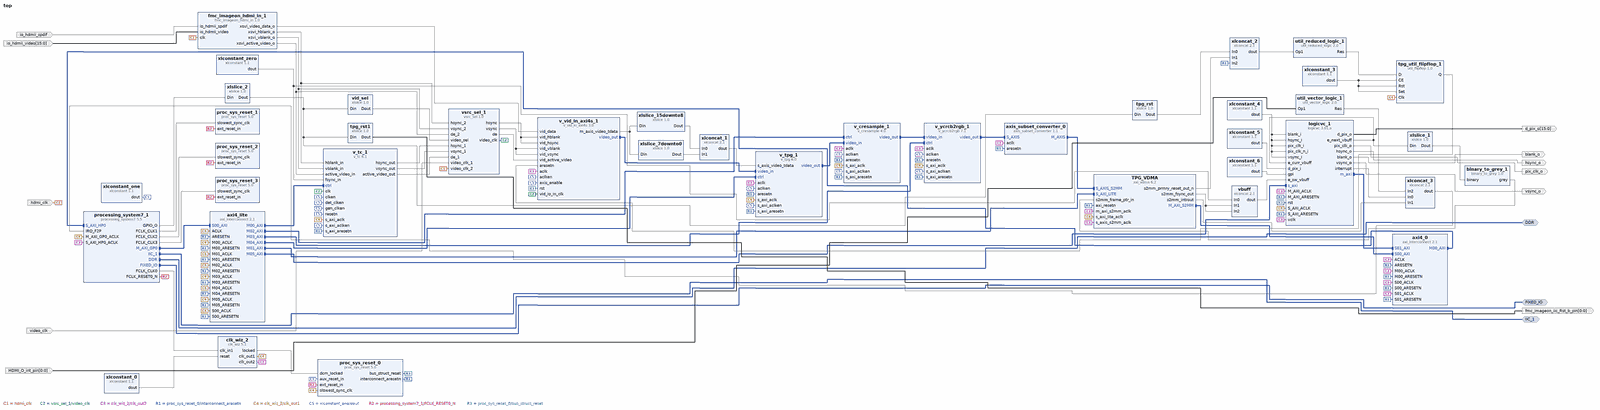
[diagram p0: block diagram of the top level, whole]
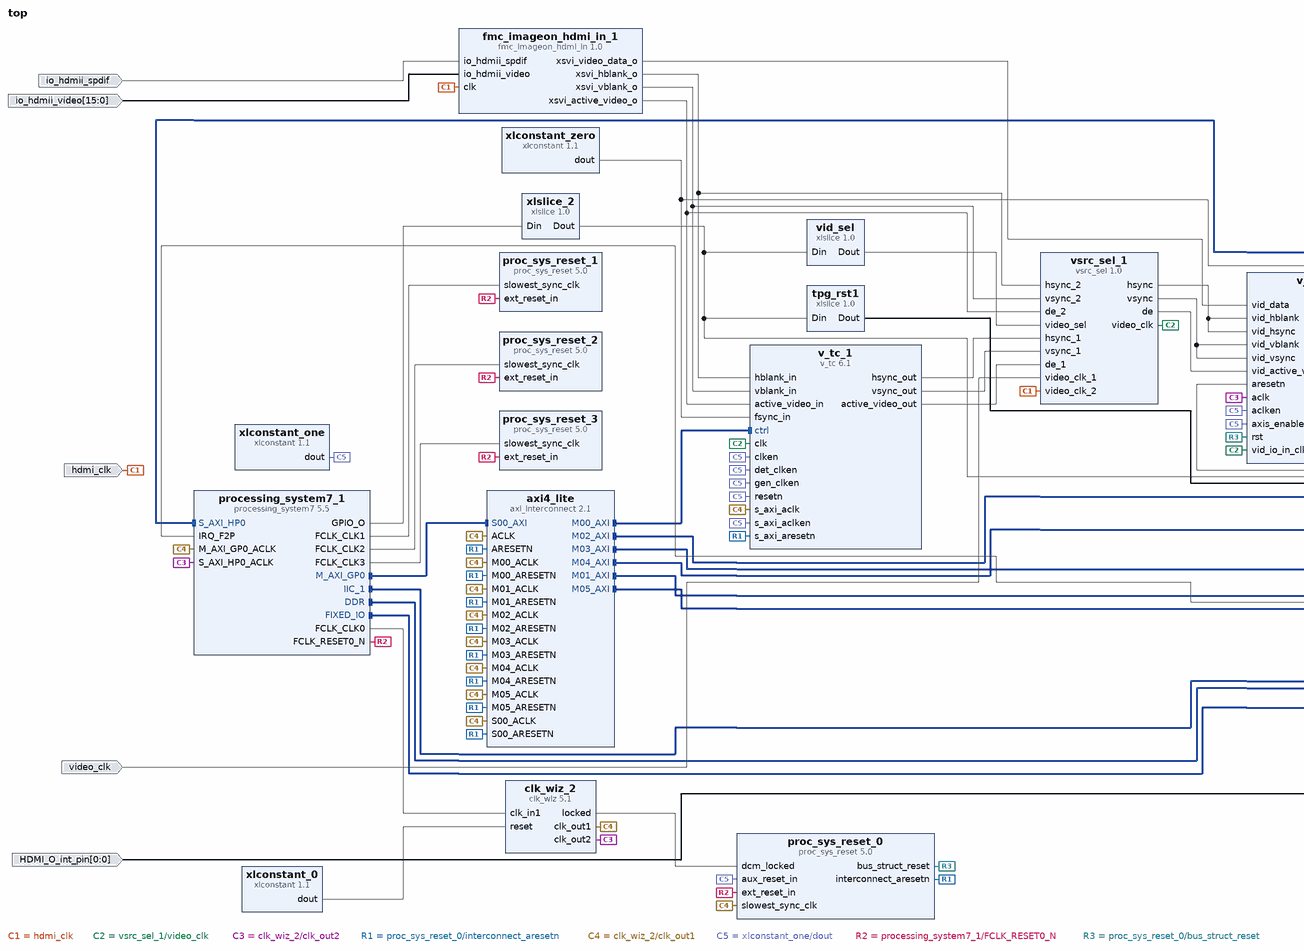
[diagram p1: block diagram of the top level, left part]
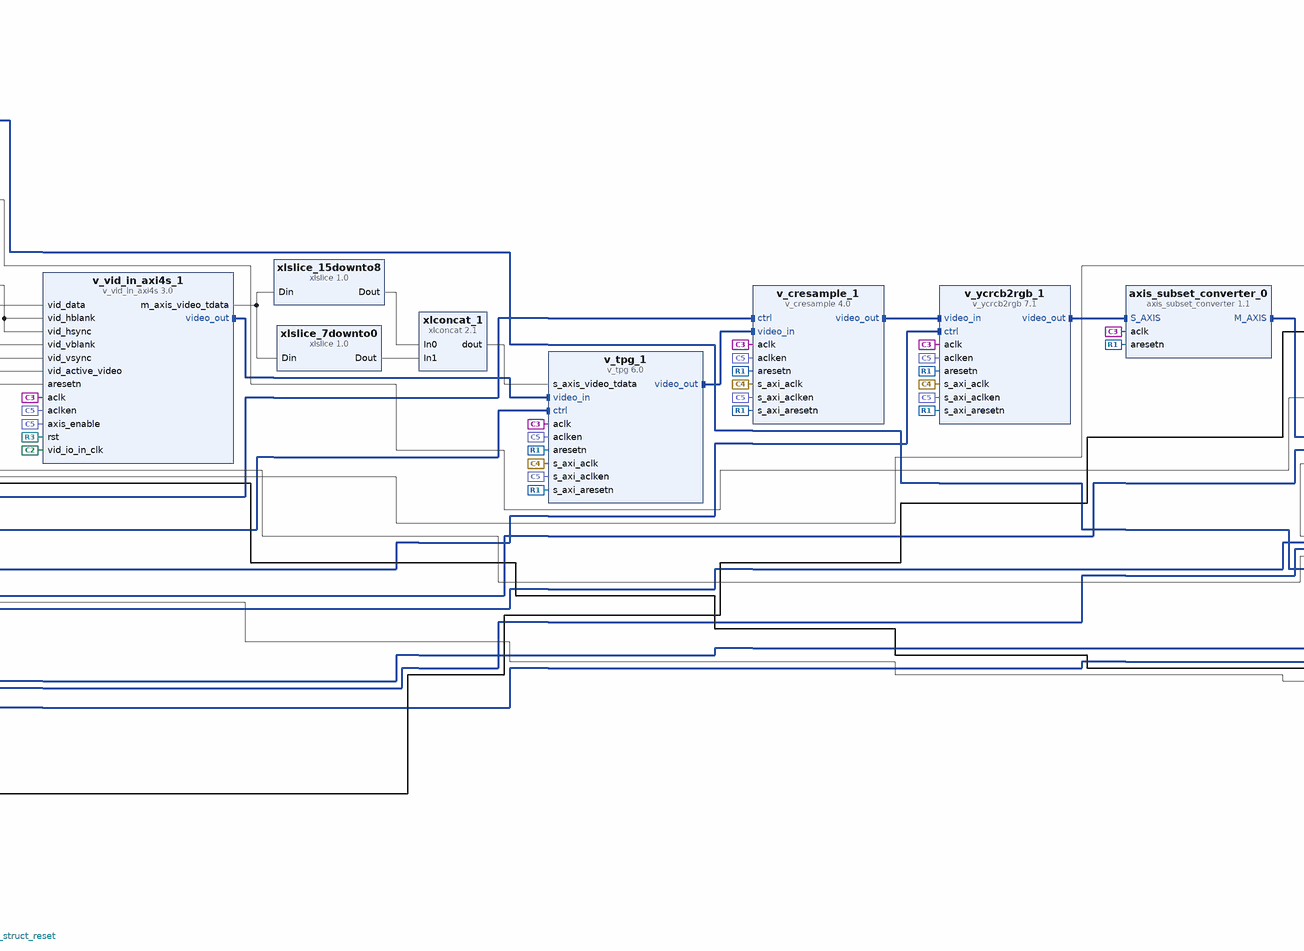
[diagram p2: block diagram of the top level, centre part]
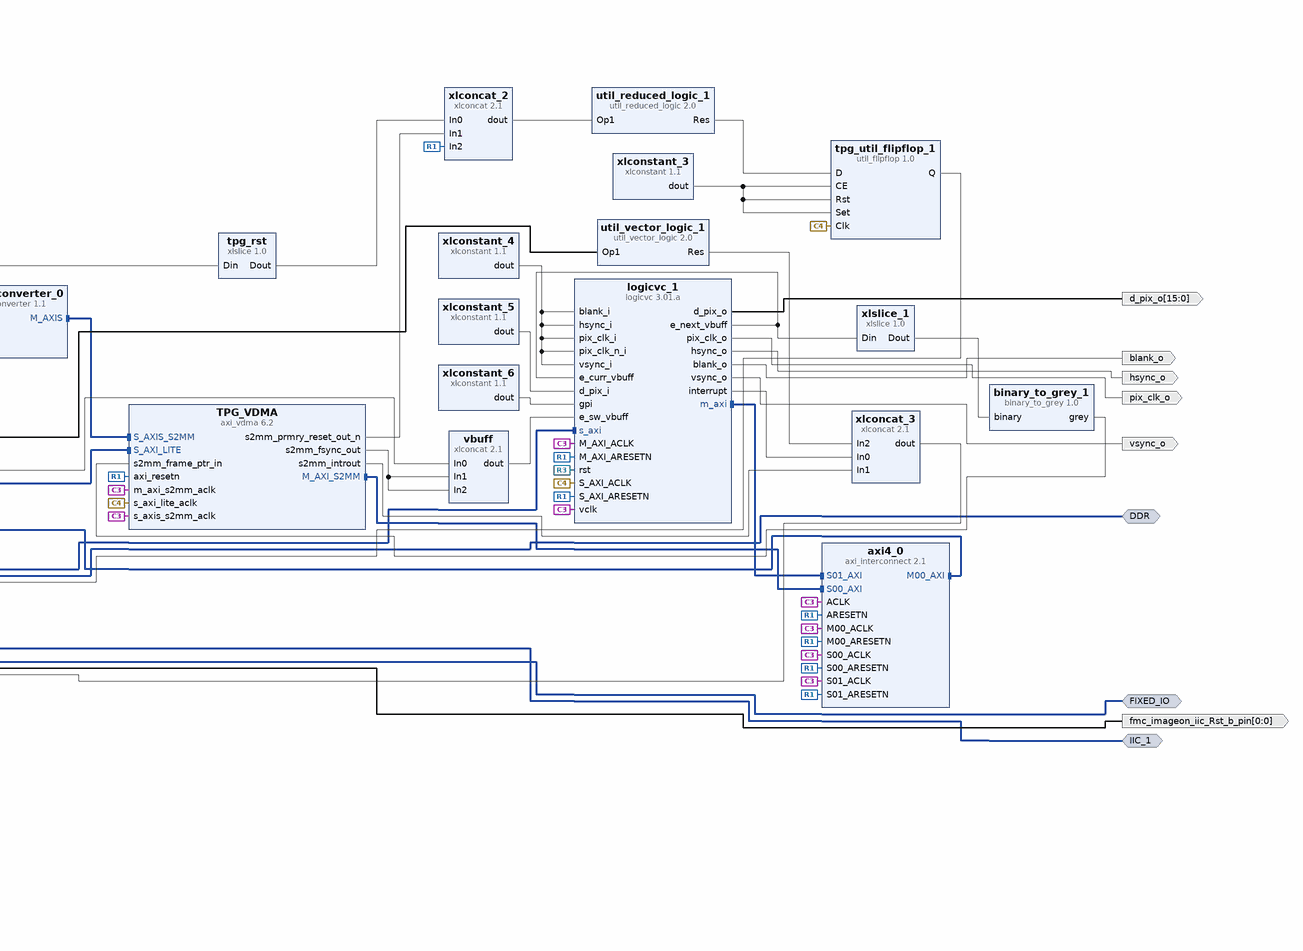
[diagram p3: block diagram of the top level, right part]
# Vivado block design top, Vivado 2015.2
create_bd_design top

create_bd_intf_port -mode Master -vlnv xilinx.com:interface:iic_rtl:1.0 IIC_1
create_bd_intf_port -mode Master -vlnv xilinx.com:interface:ddrx_rtl:1.0 DDR
create_bd_intf_port -mode Master -vlnv xilinx.com:display_processing_system7:fixedio_rtl:1.0 FIXED_IO
create_bd_port -dir I hdmi_clk
create_bd_port -dir I io_hdmii_spdif
create_bd_port -dir I -from 15 -to 0 io_hdmii_video
create_bd_port -dir I video_clk
create_bd_port -dir O -from 0 -to 0 fmc_imageon_iic_Rst_b_pin
create_bd_port -dir O pix_clk_o
create_bd_port -dir O -from 15 -to 0 d_pix_o
create_bd_port -dir O hsync_o
create_bd_port -dir O vsync_o
create_bd_port -dir O blank_o
create_bd_port -dir I -from 0 -to 0 HDMI_O_int_pin

create_bd_cell -type ip -vlnv xilinx.com:ip:fmc_imageon_hdmi_in:1.0 fmc_imageon_hdmi_in_1
create_bd_cell -type ip -vlnv xilinx.com:user:vsrc_sel:1.0 vsrc_sel_1
set_property -dict {CONFIG.C_NUM_CHANNELS 1} [get_bd_cells vsrc_sel_1]
create_bd_cell -type ip -vlnv xilinx.com:ip:xlslice:1.0 vid_sel
set_property -dict {CONFIG.DIN_TO 3 CONFIG.DIN_FROM 3 CONFIG.DIN_WIDTH 8} [get_bd_cells vid_sel]
create_bd_cell -type ip -vlnv xilinx.com:ip:xlslice:1.0 tpg_rst1
set_property -dict {CONFIG.DIN_TO 6 CONFIG.DIN_FROM 6 CONFIG.DIN_WIDTH 8} [get_bd_cells tpg_rst1]
create_bd_cell -type ip -vlnv xilinx.com:ip:xlslice:1.0 tpg_rst
set_property -dict {CONFIG.DIN_WIDTH 8} [get_bd_cells tpg_rst]
create_bd_cell -type ip -vlnv xilinx.com:user:util_flipflop:1.0 tpg_util_flipflop_1
set_property -dict [list \
  CONFIG.C_SIZE 1 \
  CONFIG.C_USE_ASYNCH 0 \
  CONFIG.C_USE_CE 0 \
  CONFIG.C_USE_SET 0 \
  CONFIG.C_USE_RST 0 \
  CONFIG.C_SET_RST_HIGH 0 \
] [get_bd_cells tpg_util_flipflop_1]
create_bd_cell -type ip -vlnv xilinx.com:ip:xlslice:1.0 xlslice_15downto8
set_property -dict {CONFIG.DIN_TO 8 CONFIG.DIN_FROM 15 CONFIG.DIN_WIDTH 16} [get_bd_cells xlslice_15downto8]
create_bd_cell -type ip -vlnv xilinx.com:ip:xlslice:1.0 xlslice_7downto0
set_property -dict {CONFIG.DIN_TO 0 CONFIG.DIN_FROM 7 CONFIG.DIN_WIDTH 16} [get_bd_cells xlslice_7downto0]
create_bd_cell -type ip -vlnv xilinx.com:ip:xlslice:1.0 xlslice_1
set_property -dict {CONFIG.DIN_TO 2 CONFIG.DIN_FROM 3 CONFIG.DIN_WIDTH 6} [get_bd_cells xlslice_1]
create_bd_cell -type ip -vlnv xylon:logicbricks:logicvc:3.01.a logicvc_1
set_property -dict [list \
  CONFIG.C_BUFFER_1_OFFSET 1080 \
  CONFIG.C_BUFFER_0_OFFSET 1080 \
  CONFIG.C_LAYER_1_OFFSET 1620 \
  CONFIG.C_USE_XTREME_DSP 1 \
  CONFIG.C_USE_BACKGROUND 1 \
  CONFIG.C_LAYER_2_DATA_WIDTH 24 \
  CONFIG.C_LAYER_1_DATA_WIDTH 24 \
  CONFIG.C_NUM_OF_LAYERS 3 \
  CONFIG.C_DISPLAY_COLOR_SPACE 1 \
  CONFIG.C_DISPLAY_INTERFACE 0 \
  CONFIG.C_ROW_STRIDE 2048 \
  CONFIG.C_M_AXI_DATA_WIDTH 64 \
  CONFIG.C_INCREASE_FIFO 2 \
  CONFIG.C_VMEM_HIGHADDR 0x37ffffff \
  CONFIG.C_VMEM_BASEADDR 0x30000000 \
] [get_bd_cells logicvc_1]
create_bd_cell -type ip -vlnv xilinx.com:user:binary_to_grey:1.0 binary_to_grey_1
create_bd_cell -type ip -vlnv xilinx.com:ip:xlslice:1.0 xlslice_2
set_property -dict {CONFIG.DIN_FROM 7 CONFIG.DIN_WIDTH 64} [get_bd_cells xlslice_2]
create_bd_cell -type ip -vlnv xilinx.com:ip:util_reduced_logic:2.0 util_reduced_logic_1
set_property -dict {CONFIG.C_SIZE 3} [get_bd_cells util_reduced_logic_1]
create_bd_cell -type ip -vlnv xilinx.com:ip:util_vector_logic:2.0 util_vector_logic_1
set_property -dict {CONFIG.C_SIZE 1 CONFIG.C_OPERATION not} [get_bd_cells util_vector_logic_1]
create_bd_cell -type ip -vlnv xilinx.com:ip:xlconcat:2.1 vbuff
set_property -dict {CONFIG.NUM_PORTS 3} [get_bd_cells vbuff]
create_bd_cell -type ip -vlnv xilinx.com:ip:xlconcat:2.1 xlconcat_1
set_property -dict {CONFIG.IN0_WIDTH 8 CONFIG.IN1_WIDTH 8} [get_bd_cells xlconcat_1]
create_bd_cell -type ip -vlnv xilinx.com:ip:xlconcat:2.1 xlconcat_2
set_property -dict {CONFIG.NUM_PORTS 3} [get_bd_cells xlconcat_2]
create_bd_cell -type ip -vlnv xilinx.com:ip:xlconcat:2.1 xlconcat_3
set_property -dict {CONFIG.NUM_PORTS 3} [get_bd_cells xlconcat_3]
create_bd_cell -type ip -vlnv xilinx.com:ip:xlconstant:1.1 xlconstant_0
set_property -dict {CONFIG.CONST_VAL 0} [get_bd_cells xlconstant_0]
create_bd_cell -type ip -vlnv xilinx.com:ip:xlconstant:1.1 xlconstant_3
create_bd_cell -type ip -vlnv xilinx.com:ip:xlconstant:1.1 xlconstant_4
set_property -dict {CONFIG.CONST_VAL 0} [get_bd_cells xlconstant_4]
create_bd_cell -type ip -vlnv xilinx.com:ip:xlconstant:1.1 xlconstant_5
set_property -dict {CONFIG.CONST_WIDTH 16 CONFIG.CONST_VAL 0} [get_bd_cells xlconstant_5]
create_bd_cell -type ip -vlnv xilinx.com:ip:xlconstant:1.1 xlconstant_6
set_property -dict {CONFIG.CONST_WIDTH 5 CONFIG.CONST_VAL 0} [get_bd_cells xlconstant_6]
create_bd_cell -type ip -vlnv xilinx.com:ip:xlconstant:1.1 xlconstant_one
create_bd_cell -type ip -vlnv xilinx.com:ip:xlconstant:1.1 xlconstant_zero
set_property -dict {CONFIG.CONST_VAL 0} [get_bd_cells xlconstant_zero]
create_bd_cell -type ip -vlnv xilinx.com:ip:axis_subset_converter:1.1 axis_subset_converter_0
set_property -dict [list \
  CONFIG.S_TDATA_NUM_BYTES 3 \
  CONFIG.M_TDATA_NUM_BYTES 4 \
  CONFIG.S_TUSER_WIDTH 1 \
  CONFIG.M_TUSER_WIDTH 1 \
  CONFIG.S_HAS_TKEEP 0 \
  CONFIG.S_HAS_TLAST 1 \
  CONFIG.M_HAS_TKEEP 1 \
  CONFIG.M_HAS_TLAST 1 \
  CONFIG.TDATA_REMAP {8'b11111111,tdata[23:16],tdata[7:0],tdata[15:8]} \
  CONFIG.TUSER_REMAP {tuser[0:0]} \
] [get_bd_cells axis_subset_converter_0]
create_bd_cell -type ip -vlnv xilinx.com:ip:proc_sys_reset:5.0 proc_sys_reset_0
set_property -dict {CONFIG.C_AUX_RESET_HIGH 0} [get_bd_cells proc_sys_reset_0]
create_bd_cell -type ip -vlnv xilinx.com:ip:proc_sys_reset:5.0 proc_sys_reset_1
set_property -dict {CONFIG.C_AUX_RESET_HIGH 0} [get_bd_cells proc_sys_reset_1]
create_bd_cell -type ip -vlnv xilinx.com:ip:proc_sys_reset:5.0 proc_sys_reset_2
set_property -dict {CONFIG.C_AUX_RESET_HIGH 0} [get_bd_cells proc_sys_reset_2]
create_bd_cell -type ip -vlnv xilinx.com:ip:proc_sys_reset:5.0 proc_sys_reset_3
set_property -dict {CONFIG.C_AUX_RESET_HIGH 0} [get_bd_cells proc_sys_reset_3]
create_bd_cell -type ip -vlnv xilinx.com:ip:processing_system7:5.5 processing_system7_1
set_property -dict [list \
  CONFIG.PCW_FCLK_CLK1_BUF true \
  CONFIG.PCW_FCLK_CLK2_BUF true \
  CONFIG.PCW_FCLK_CLK3_BUF true \
  CONFIG.PCW_UIPARAM_DDR_FREQ_MHZ 533.333333 \
  CONFIG.PCW_APU_PERIPHERAL_FREQMHZ 666.666666 \
  CONFIG.PCW_SDIO_PERIPHERAL_FREQMHZ 50 \
  CONFIG.PCW_UART_PERIPHERAL_FREQMHZ 50 \
  CONFIG.PCW_I2C_PERIPHERAL_FREQMHZ 111.111115 \
  CONFIG.PCW_FPGA0_PERIPHERAL_FREQMHZ 100 \
  CONFIG.PCW_FPGA1_PERIPHERAL_FREQMHZ 142 \
  CONFIG.PCW_FPGA2_PERIPHERAL_FREQMHZ 100 \
  CONFIG.PCW_FPGA3_PERIPHERAL_FREQMHZ 166.666672 \
  CONFIG.PCW_USE_S_AXI_HP0 1 \
  CONFIG.PCW_M_AXI_GP0_FREQMHZ 75 \
  CONFIG.PCW_S_AXI_HP0_FREQMHZ 150 \
  CONFIG.PCW_USE_FABRIC_INTERRUPT 1 \
  CONFIG.PCW_EN_CLK1_PORT 1 \
  CONFIG.PCW_EN_CLK2_PORT 1 \
  CONFIG.PCW_EN_CLK3_PORT 1 \
  CONFIG.PCW_IRQ_F2P_INTR 1 \
  CONFIG.PCW_PERIPHERAL_BOARD_PRESET part0 \
  CONFIG.PCW_PRESET_BANK0_VOLTAGE {LVCMOS 1.8V} \
  CONFIG.PCW_PRESET_BANK1_VOLTAGE {LVCMOS 1.8V} \
  CONFIG.PCW_UIPARAM_DDR_PARTNO {MT41J256M8 HX-15E} \
  CONFIG.PCW_QSPI_PERIPHERAL_ENABLE 0 \
  CONFIG.PCW_ENET0_PERIPHERAL_ENABLE 1 \
  CONFIG.PCW_ENET0_ENET0_IO {MIO 16 .. 27} \
  CONFIG.PCW_ENET0_GRP_MDIO_ENABLE 1 \
  CONFIG.PCW_ENET0_GRP_MDIO_IO {MIO 52 .. 53} \
  CONFIG.PCW_ENET0_RESET_ENABLE 1 \
  CONFIG.PCW_ENET0_RESET_IO {MIO 11} \
  CONFIG.PCW_SD0_PERIPHERAL_ENABLE 1 \
  CONFIG.PCW_SD0_SD0_IO {MIO 40 .. 45} \
  CONFIG.PCW_SD0_GRP_CD_ENABLE 1 \
  CONFIG.PCW_SD0_GRP_CD_IO {MIO 0} \
  CONFIG.PCW_SD0_GRP_WP_ENABLE 1 \
  CONFIG.PCW_SD0_GRP_WP_IO {MIO 15} \
  CONFIG.PCW_UART1_PERIPHERAL_ENABLE 1 \
  CONFIG.PCW_UART1_UART1_IO {MIO 48 .. 49} \
  CONFIG.PCW_TTC0_PERIPHERAL_ENABLE 1 \
  CONFIG.PCW_TTC0_TTC0_IO EMIO \
  CONFIG.PCW_USB0_PERIPHERAL_ENABLE 1 \
  CONFIG.PCW_USB0_USB0_IO {MIO 28 .. 39} \
  CONFIG.PCW_USB0_RESET_ENABLE 1 \
  CONFIG.PCW_USB0_RESET_IO {MIO 7} \
  CONFIG.PCW_I2C0_PERIPHERAL_ENABLE 1 \
  CONFIG.PCW_I2C0_I2C0_IO {MIO 50 .. 51} \
  CONFIG.PCW_I2C0_GRP_INT_ENABLE 0 \
  CONFIG.PCW_I2C0_RESET_ENABLE 1 \
  CONFIG.PCW_I2C0_RESET_IO {MIO 13} \
  CONFIG.PCW_I2C1_PERIPHERAL_ENABLE 1 \
  CONFIG.PCW_I2C1_I2C1_IO EMIO \
  CONFIG.PCW_GPIO_MIO_GPIO_ENABLE 1 \
  CONFIG.PCW_GPIO_MIO_GPIO_IO MIO \
  CONFIG.PCW_GPIO_EMIO_GPIO_ENABLE 1 \
  CONFIG.PCW_GPIO_EMIO_GPIO_IO 64 \
  CONFIG.PCW_ENET0_PERIPHERAL_FREQMHZ {100 Mbps} \
  CONFIG.PCW_DCI_PERIPHERAL_CLKSRC 1 \
  CONFIG.PCW_PCAP_PERIPHERAL_CLKSRC 1 \
  CONFIG.preset ZC702 \
  CONFIG.PCW_FPGA_FCLK1_ENABLE 1 \
  CONFIG.PCW_FPGA_FCLK2_ENABLE 1 \
  CONFIG.PCW_FPGA_FCLK3_ENABLE 1 \
] [get_bd_cells processing_system7_1]
# 359 more settings of processing_system7_1 are not shown: defaults, MIO pin electricals, DDR timing, and values the tool derives
create_bd_cell -type ip -vlnv xilinx.com:ip:v_cresample:4.0 v_cresample_1
set_property -dict {CONFIG.has_axi4_lite true CONFIG.convert_type 2} [get_bd_cells v_cresample_1]
create_bd_cell -type ip -vlnv xilinx.com:ip:v_tc:6.1 v_tc_1
set_property -dict [list \
  CONFIG.VIDEO_MODE 1080p \
  CONFIG.enable_detection true \
  CONFIG.vertical_blank_generation true \
  CONFIG.horizontal_sync_detection false \
  CONFIG.vertical_sync_detection false \
] [get_bd_cells v_tc_1]
create_bd_cell -type ip -vlnv xilinx.com:ip:v_tpg:6.0 v_tpg_1
set_property -dict {CONFIG.pattern_control 10} [get_bd_cells v_tpg_1]
create_bd_cell -type ip -vlnv xilinx.com:ip:v_vid_in_axi4s:3.0 v_vid_in_axi4s_1
set_property -dict {CONFIG.C_M_AXIS_VIDEO_FORMAT 0} [get_bd_cells v_vid_in_axi4s_1]
create_bd_cell -type ip -vlnv xilinx.com:ip:v_ycrcb2rgb:7.1 v_ycrcb2rgb_1
set_property -dict [list \
  CONFIG.HAS_AXI4_LITE true \
  CONFIG.HAS_INTC_IF false \
  CONFIG.Standard_Sel HD_ITU_709__1250_PAL \
  CONFIG.Output_Range 0_to_255_for_Computer_Graphics \
] [get_bd_cells v_ycrcb2rgb_1]
create_bd_cell -type ip -vlnv xilinx.com:ip:axi_vdma:6.2 TPG_VDMA
set_property -dict [list \
  CONFIG.c_m_axi_s2mm_data_width 64 \
  CONFIG.c_include_s2mm_dre 0 \
  CONFIG.c_include_s2mm_sf 0 \
  CONFIG.c_s2mm_sof_enable 1 \
  CONFIG.c_s2mm_genlock_mode 3 \
  CONFIG.c_s2mm_linebuffer_depth 4096 \
  CONFIG.c_include_mm2s 0 \
  CONFIG.c_s2mm_max_burst_length 16 \
  CONFIG.c_enable_debug_info_6 0 \
  CONFIG.c_enable_debug_info_7 0 \
  CONFIG.c_enable_debug_info_8 1 \
  CONFIG.c_enable_debug_info_11 1 \
  CONFIG.c_enable_debug_info_14 0 \
  CONFIG.c_enable_debug_info_15 1 \
] [get_bd_cells TPG_VDMA]
create_bd_cell -type ip -vlnv xilinx.com:ip:axi_interconnect:2.1 axi4_0
set_property -dict [list \
  CONFIG.NUM_SI 2 \
  CONFIG.NUM_MI 1 \
  CONFIG.STRATEGY 2 \
  CONFIG.ENABLE_ADVANCED_OPTIONS 1 \
  CONFIG.M00_HAS_REGSLICE 1 \
  CONFIG.M00_HAS_DATA_FIFO 2 \
  CONFIG.S00_HAS_REGSLICE 1 \
  CONFIG.S01_HAS_REGSLICE 1 \
] [get_bd_cells axi4_0]
create_bd_cell -type ip -vlnv xilinx.com:ip:axi_interconnect:2.1 axi4_lite
set_property -dict {CONFIG.NUM_MI 6 CONFIG.M06_HAS_REGSLICE 1} [get_bd_cells axi4_lite]
create_bd_cell -type ip -vlnv xilinx.com:ip:clk_wiz:5.1 clk_wiz_2
set_property -dict [list \
  CONFIG.USE_INCLK_SWITCHOVER false \
  CONFIG.CLKOUT2_USED true \
  CONFIG.NUM_OUT_CLKS 2 \
  CONFIG.CLKOUT1_REQUESTED_OUT_FREQ 75.000 \
  CONFIG.CLKOUT2_REQUESTED_OUT_FREQ 150.000 \
  CONFIG.CLKOUT1_JITTER 133.854 \
  CONFIG.CLKOUT1_PHASE_ERROR 94.994 \
  CONFIG.CLKOUT2_JITTER 116.798 \
  CONFIG.CLKOUT2_PHASE_ERROR 94.994 \
] [get_bd_cells clk_wiz_2]

# ---- connections ----

connect_bd_intf_net [get_bd_intf_pins v_ycrcb2rgb_1/video_out] [get_bd_intf_pins axis_subset_converter_0/S_AXIS]
connect_bd_intf_net -intf_net axi_interconnect_1_m00_axi [get_bd_intf_pins axi4_0/M00_AXI] [get_bd_intf_pins processing_system7_1/S_AXI_HP0]
connect_bd_intf_net -intf_net axi_vdma_1_m_axi_s2mm [get_bd_intf_pins TPG_VDMA/M_AXI_S2MM] [get_bd_intf_pins axi4_0/S00_AXI]
connect_bd_intf_net [get_bd_intf_pins v_cresample_1/video_out] [get_bd_intf_pins v_ycrcb2rgb_1/video_in]
connect_bd_intf_net -intf_net axi_interconnect_2_m00_axi [get_bd_intf_pins axi4_lite/M00_AXI] [get_bd_intf_pins v_tc_1/ctrl]
connect_bd_intf_net -intf_net axi_interconnect_2_m02_axi [get_bd_intf_pins axi4_lite/M02_AXI] [get_bd_intf_pins v_cresample_1/ctrl]
connect_bd_intf_net -intf_net axi_interconnect_2_m03_axi [get_bd_intf_pins axi4_lite/M03_AXI] [get_bd_intf_pins v_ycrcb2rgb_1/ctrl]
connect_bd_intf_net [get_bd_intf_pins axi4_lite/S00_AXI] [get_bd_intf_pins processing_system7_1/M_AXI_GP0]
connect_bd_intf_net -intf_net axi_interconnect_2_m01_axi [get_bd_intf_pins TPG_VDMA/S_AXI_LITE] [get_bd_intf_pins axi4_lite/M01_AXI]
connect_bd_intf_net [get_bd_intf_pins v_tpg_1/video_out] [get_bd_intf_pins v_cresample_1/video_in]
connect_bd_intf_net [get_bd_intf_pins v_vid_in_axi4s_1/video_out] [get_bd_intf_pins v_tpg_1/video_in]
connect_bd_intf_net -intf_net axi_interconnect_2_m04_axi [get_bd_intf_pins axi4_lite/M04_AXI] [get_bd_intf_pins v_tpg_1/ctrl]
connect_bd_intf_net [get_bd_intf_pins axi4_lite/M05_AXI] [get_bd_intf_pins logicvc_1/s_axi]
connect_bd_intf_net [get_bd_intf_pins axi4_0/S01_AXI] [get_bd_intf_pins logicvc_1/m_axi]
connect_bd_intf_net [get_bd_intf_pins axis_subset_converter_0/M_AXIS] [get_bd_intf_pins TPG_VDMA/S_AXIS_S2MM]
connect_bd_intf_net [get_bd_intf_ports IIC_1] [get_bd_intf_pins processing_system7_1/IIC_1]
connect_bd_intf_net [get_bd_intf_ports DDR] [get_bd_intf_pins processing_system7_1/DDR]
connect_bd_intf_net [get_bd_intf_ports FIXED_IO] [get_bd_intf_pins processing_system7_1/FIXED_IO]
connect_bd_net -net clk_1 [get_bd_ports hdmi_clk] [get_bd_pins fmc_imageon_hdmi_in_1/clk] [get_bd_pins vsrc_sel_1/video_clk_2]
connect_bd_net [get_bd_ports io_hdmii_spdif] [get_bd_pins fmc_imageon_hdmi_in_1/io_hdmii_spdif]
connect_bd_net [get_bd_ports io_hdmii_video] [get_bd_pins fmc_imageon_hdmi_in_1/io_hdmii_video]
connect_bd_net [get_bd_pins fmc_imageon_hdmi_in_1/xsvi_hblank_o] [get_bd_pins vsrc_sel_1/hsync_2] [get_bd_pins v_tc_1/hblank_in]
connect_bd_net [get_bd_pins fmc_imageon_hdmi_in_1/xsvi_vblank_o] [get_bd_pins vsrc_sel_1/vsync_2] [get_bd_pins v_tc_1/vblank_in]
connect_bd_net [get_bd_pins fmc_imageon_hdmi_in_1/xsvi_active_video_o] [get_bd_pins vsrc_sel_1/de_2] [get_bd_pins v_tc_1/active_video_in]
connect_bd_net [get_bd_pins vsrc_sel_1/video_clk] [get_bd_pins v_tc_1/clk] [get_bd_pins v_vid_in_axi4s_1/vid_io_in_clk]
connect_bd_net [get_bd_pins v_tc_1/hsync_out] [get_bd_pins vsrc_sel_1/hsync_1]
connect_bd_net [get_bd_pins v_tc_1/vsync_out] [get_bd_pins vsrc_sel_1/vsync_1]
connect_bd_net [get_bd_pins v_tc_1/active_video_out] [get_bd_pins vsrc_sel_1/de_1]
connect_bd_net -net clk_150mhz [get_bd_pins clk_wiz_2/clk_out2] \
  [get_bd_pins logicvc_1/vclk] [get_bd_pins logicvc_1/M_AXI_ACLK] [get_bd_pins axis_subset_converter_0/aclk] \
  [get_bd_pins processing_system7_1/S_AXI_HP0_ACLK] [get_bd_pins v_cresample_1/aclk] [get_bd_pins v_tpg_1/aclk] \
  [get_bd_pins v_vid_in_axi4s_1/aclk] [get_bd_pins v_ycrcb2rgb_1/aclk] [get_bd_pins TPG_VDMA/m_axi_s2mm_aclk] \
  [get_bd_pins TPG_VDMA/s_axis_s2mm_aclk] [get_bd_pins axi4_0/ACLK] [get_bd_pins axi4_0/S00_ACLK] \
  [get_bd_pins axi4_0/S01_ACLK] [get_bd_pins axi4_0/M00_ACLK]
connect_bd_net [get_bd_pins proc_sys_reset_0/interconnect_aresetn] \
  [get_bd_pins logicvc_1/M_AXI_ARESETN] [get_bd_pins logicvc_1/S_AXI_ARESETN] [get_bd_pins xlconcat_2/In2] \
  [get_bd_pins axis_subset_converter_0/aresetn] [get_bd_pins v_cresample_1/aresetn] [get_bd_pins v_cresample_1/s_axi_aresetn] \
  [get_bd_pins v_tc_1/s_axi_aresetn] [get_bd_pins v_tpg_1/aresetn] [get_bd_pins v_tpg_1/s_axi_aresetn] \
  [get_bd_pins v_ycrcb2rgb_1/aresetn] [get_bd_pins v_ycrcb2rgb_1/s_axi_aresetn] [get_bd_pins TPG_VDMA/axi_resetn] \
  [get_bd_pins axi4_0/ARESETN] [get_bd_pins axi4_0/S00_ARESETN] [get_bd_pins axi4_0/S01_ARESETN] \
  [get_bd_pins axi4_0/M00_ARESETN] [get_bd_pins axi4_lite/ARESETN] [get_bd_pins axi4_lite/S00_ARESETN] \
  [get_bd_pins axi4_lite/M00_ARESETN] [get_bd_pins axi4_lite/M01_ARESETN] [get_bd_pins axi4_lite/M02_ARESETN] \
  [get_bd_pins axi4_lite/M03_ARESETN] [get_bd_pins axi4_lite/M04_ARESETN] [get_bd_pins axi4_lite/M05_ARESETN]
connect_bd_net [get_bd_pins fmc_imageon_hdmi_in_1/xsvi_video_data_o] [get_bd_pins v_vid_in_axi4s_1/vid_data]
connect_bd_net [get_bd_pins vsrc_sel_1/hsync] [get_bd_pins v_vid_in_axi4s_1/vid_hblank] [get_bd_pins v_vid_in_axi4s_1/vid_hsync]
connect_bd_net [get_bd_pins vsrc_sel_1/vsync] [get_bd_pins v_vid_in_axi4s_1/vid_vblank] [get_bd_pins v_vid_in_axi4s_1/vid_vsync]
connect_bd_net [get_bd_pins vsrc_sel_1/de] [get_bd_pins v_vid_in_axi4s_1/vid_active_video]
connect_bd_net -net xlconstant_zero_const [get_bd_pins xlconstant_zero/dout] [get_bd_pins vbuff/In0] [get_bd_pins v_tc_1/fsync_in]
connect_bd_net [get_bd_pins v_vid_in_axi4s_1/m_axis_video_tdata] [get_bd_pins xlslice_7downto0/Din] [get_bd_pins xlslice_15downto8/Din]
connect_bd_net -net clk_75mhz [get_bd_pins clk_wiz_2/clk_out1] \
  [get_bd_pins tpg_util_flipflop_1/Clk] [get_bd_pins logicvc_1/S_AXI_ACLK] [get_bd_pins proc_sys_reset_0/slowest_sync_clk] \
  [get_bd_pins processing_system7_1/M_AXI_GP0_ACLK] [get_bd_pins v_cresample_1/s_axi_aclk] [get_bd_pins v_tc_1/s_axi_aclk] \
  [get_bd_pins v_tpg_1/s_axi_aclk] [get_bd_pins v_ycrcb2rgb_1/s_axi_aclk] [get_bd_pins TPG_VDMA/s_axi_lite_aclk] \
  [get_bd_pins axi4_lite/ACLK] [get_bd_pins axi4_lite/S00_ACLK] [get_bd_pins axi4_lite/M00_ACLK] \
  [get_bd_pins axi4_lite/M01_ACLK] [get_bd_pins axi4_lite/M02_ACLK] [get_bd_pins axi4_lite/M03_ACLK] \
  [get_bd_pins axi4_lite/M04_ACLK] [get_bd_pins axi4_lite/M05_ACLK]
connect_bd_net -net axi_vdma_1_s2mm_prmry_reset_out_n [get_bd_pins TPG_VDMA/s2mm_prmry_reset_out_n] [get_bd_pins xlconcat_2/In1]
connect_bd_net -net xlconstant_1_const [get_bd_pins xlconstant_one/dout] \
  [get_bd_pins proc_sys_reset_0/aux_reset_in] [get_bd_pins v_cresample_1/aclken] [get_bd_pins v_cresample_1/s_axi_aclken] \
  [get_bd_pins v_tc_1/clken] [get_bd_pins v_tc_1/s_axi_aclken] [get_bd_pins v_tc_1/det_clken] [get_bd_pins v_tc_1/gen_clken] \
  [get_bd_pins v_tc_1/resetn] [get_bd_pins v_tpg_1/aclken] [get_bd_pins v_tpg_1/s_axi_aclken] \
  [get_bd_pins v_vid_in_axi4s_1/aclken] [get_bd_pins v_vid_in_axi4s_1/axis_enable] [get_bd_pins v_ycrcb2rgb_1/aclken] \
  [get_bd_pins v_ycrcb2rgb_1/s_axi_aclken]
connect_bd_net [get_bd_ports video_clk] [get_bd_pins vsrc_sel_1/video_clk_1]
connect_bd_net [get_bd_pins xlslice_2/Dout] [get_bd_pins tpg_rst1/Din] [get_bd_pins vid_sel/Din] [get_bd_pins tpg_rst/Din]
connect_bd_net [get_bd_pins processing_system7_1/GPIO_O] [get_bd_pins xlslice_2/Din]
connect_bd_net -net xlslice_1_dout [get_bd_pins vid_sel/Dout] [get_bd_pins vsrc_sel_1/video_sel]
connect_bd_net [get_bd_pins tpg_rst1/Dout] [get_bd_ports fmc_imageon_iic_Rst_b_pin]
connect_bd_net [get_bd_pins xlconcat_1/dout] [get_bd_pins v_tpg_1/s_axis_video_tdata]
connect_bd_net [get_bd_pins processing_system7_1/FCLK_RESET0_N] \
  [get_bd_pins proc_sys_reset_0/ext_reset_in] [get_bd_pins proc_sys_reset_1/ext_reset_in] \
  [get_bd_pins proc_sys_reset_2/ext_reset_in] [get_bd_pins proc_sys_reset_3/ext_reset_in]
connect_bd_net -net proc_sys_reset_1_bus_struct_reset [get_bd_pins proc_sys_reset_0/bus_struct_reset] \
  [get_bd_pins logicvc_1/rst] [get_bd_pins v_vid_in_axi4s_1/rst]
connect_bd_net -net axi_vdma_1_s2mm_introut [get_bd_pins TPG_VDMA/s2mm_introut] [get_bd_pins xlconcat_3/In1]
connect_bd_net -net axi_vdma_1_s2mm_fsync_out [get_bd_pins TPG_VDMA/s2mm_fsync_out] [get_bd_pins vbuff/In1] [get_bd_pins vbuff/In2]
connect_bd_net [get_bd_pins logicvc_1/pix_clk_o] [get_bd_ports pix_clk_o]
connect_bd_net [get_bd_pins logicvc_1/d_pix_o] [get_bd_ports d_pix_o]
connect_bd_net [get_bd_pins logicvc_1/hsync_o] [get_bd_ports hsync_o]
connect_bd_net [get_bd_pins logicvc_1/vsync_o] [get_bd_ports vsync_o]
connect_bd_net [get_bd_pins logicvc_1/blank_o] [get_bd_ports blank_o]
connect_bd_net [get_bd_pins vbuff/dout] [get_bd_pins logicvc_1/e_sw_vbuff]
connect_bd_net [get_bd_pins logicvc_1/interrupt] [get_bd_pins xlconcat_3/In0]
connect_bd_net -net util_flipflop_1_q [get_bd_pins tpg_util_flipflop_1/Q] [get_bd_pins v_vid_in_axi4s_1/aresetn]
connect_bd_net -net xlslice_1_dout1 [get_bd_pins tpg_rst/Dout] [get_bd_pins xlconcat_2/In0]
connect_bd_net [get_bd_pins xlconcat_2/dout] [get_bd_pins util_reduced_logic_1/Op1]
connect_bd_net [get_bd_pins util_reduced_logic_1/Res] [get_bd_pins tpg_util_flipflop_1/D]
connect_bd_net [get_bd_pins xlslice_15downto8/Dout] [get_bd_pins xlconcat_1/In0]
connect_bd_net [get_bd_pins xlslice_7downto0/Dout] [get_bd_pins xlconcat_1/In1]
connect_bd_net [get_bd_pins processing_system7_1/FCLK_CLK0] [get_bd_pins clk_wiz_2/clk_in1]
connect_bd_net -net clk_wiz_1_locked [get_bd_pins clk_wiz_2/locked] [get_bd_pins proc_sys_reset_0/dcm_locked]
connect_bd_net -net xlconstant_3_const [get_bd_pins xlconstant_3/dout] \
  [get_bd_pins tpg_util_flipflop_1/CE] [get_bd_pins tpg_util_flipflop_1/Rst] [get_bd_pins tpg_util_flipflop_1/Set]
connect_bd_net -net xlconstant_4_const [get_bd_pins xlconstant_4/dout] \
  [get_bd_pins logicvc_1/pix_clk_i] [get_bd_pins logicvc_1/pix_clk_n_i] [get_bd_pins logicvc_1/hsync_i] \
  [get_bd_pins logicvc_1/vsync_i] [get_bd_pins logicvc_1/blank_i]
connect_bd_net -net xlconstant_5_const [get_bd_pins xlconstant_5/dout] [get_bd_pins logicvc_1/d_pix_i]
connect_bd_net [get_bd_pins binary_to_grey_1/grey] [get_bd_pins TPG_VDMA/s2mm_frame_ptr_in]
connect_bd_net -net logicvc_2_e_next_vbuff [get_bd_pins logicvc_1/e_next_vbuff] [get_bd_pins xlslice_1/Din] [get_bd_pins logicvc_1/e_curr_vbuff]
connect_bd_net -net xlconstant_6_const [get_bd_pins xlconstant_6/dout] [get_bd_pins logicvc_1/gpi]
connect_bd_net [get_bd_pins xlslice_1/Dout] [get_bd_pins binary_to_grey_1/binary]
connect_bd_net [get_bd_pins util_vector_logic_1/Res] [get_bd_pins xlconcat_3/In2]
connect_bd_net -net Op1 [get_bd_ports HDMI_O_int_pin] [get_bd_pins util_vector_logic_1/Op1]
connect_bd_net -net clkid3 [get_bd_pins processing_system7_1/FCLK_CLK3] [get_bd_pins proc_sys_reset_3/slowest_sync_clk]
connect_bd_net -net clkid2 [get_bd_pins processing_system7_1/FCLK_CLK2] [get_bd_pins proc_sys_reset_2/slowest_sync_clk]
connect_bd_net -net clkid1 [get_bd_pins processing_system7_1/FCLK_CLK1] [get_bd_pins proc_sys_reset_1/slowest_sync_clk]
connect_bd_net [get_bd_pins xlconstant_0/dout] [get_bd_pins clk_wiz_2/reset]
connect_bd_net [get_bd_pins xlconcat_3/dout] [get_bd_pins processing_system7_1/IRQ_F2P]

# ---- address map ----
assign_bd_address -offset 0x30000000 -range 256M -target_address_space [get_bd_addr_spaces logicvc_1/videoData] [get_bd_addr_segs processing_system7_1/S_AXI_HP0/HP0_DDR_LOWOCM]
assign_bd_address -offset 0x40030000 -range 64K -target_address_space [get_bd_addr_spaces processing_system7_1/Data] [get_bd_addr_segs logicvc_1/s_axi/Reg]
assign_bd_address -offset 0x40040000 -range 64K -target_address_space [get_bd_addr_spaces processing_system7_1/Data] [get_bd_addr_segs v_cresample_1/ctrl/Reg]
assign_bd_address -offset 0x40050000 -range 64K -target_address_space [get_bd_addr_spaces processing_system7_1/Data] [get_bd_addr_segs v_ycrcb2rgb_1/ctrl/Reg]
assign_bd_address -offset 0x40070000 -range 64K -target_address_space [get_bd_addr_spaces processing_system7_1/Data] [get_bd_addr_segs v_tc_1/ctrl/Reg]
assign_bd_address -offset 0x40080000 -range 64K -target_address_space [get_bd_addr_spaces processing_system7_1/Data] [get_bd_addr_segs v_tpg_1/ctrl/Reg]
assign_bd_address -offset 0x40090000 -range 64K -target_address_space [get_bd_addr_spaces processing_system7_1/Data] [get_bd_addr_segs TPG_VDMA/S_AXI_LITE/Reg]
assign_bd_address -offset 0x30000000 -range 256M -target_address_space [get_bd_addr_spaces TPG_VDMA/Data_S2MM] [get_bd_addr_segs processing_system7_1/S_AXI_HP0/HP0_DDR_LOWOCM]

validate_bd_design
save_bd_design
